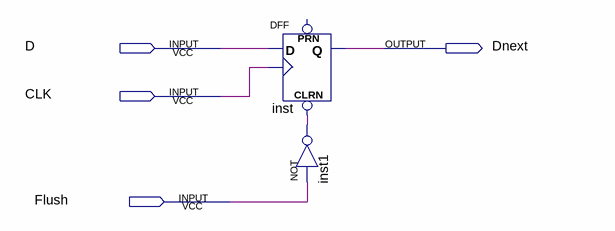
[diagram p0: schematic sheet]
// Quartus schematic Flush_test.bdf as structural Verilog: 2 symbols, 4 pins
module Flush_test (
  input  D,
  input  CLK,
  input  Flush,
  output Dnext
);

  wire inst1_out;

  DFF inst (.CLRN(inst1_out), .CLK(CLK), .D(D), .Q(Dnext));  // open: PRN
  not inst1 (inst1_out, Flush);
endmodule
